# EAGLE schematic analog_homoThermistor_3xChannel_R1 (EAGLE 7.6.0)
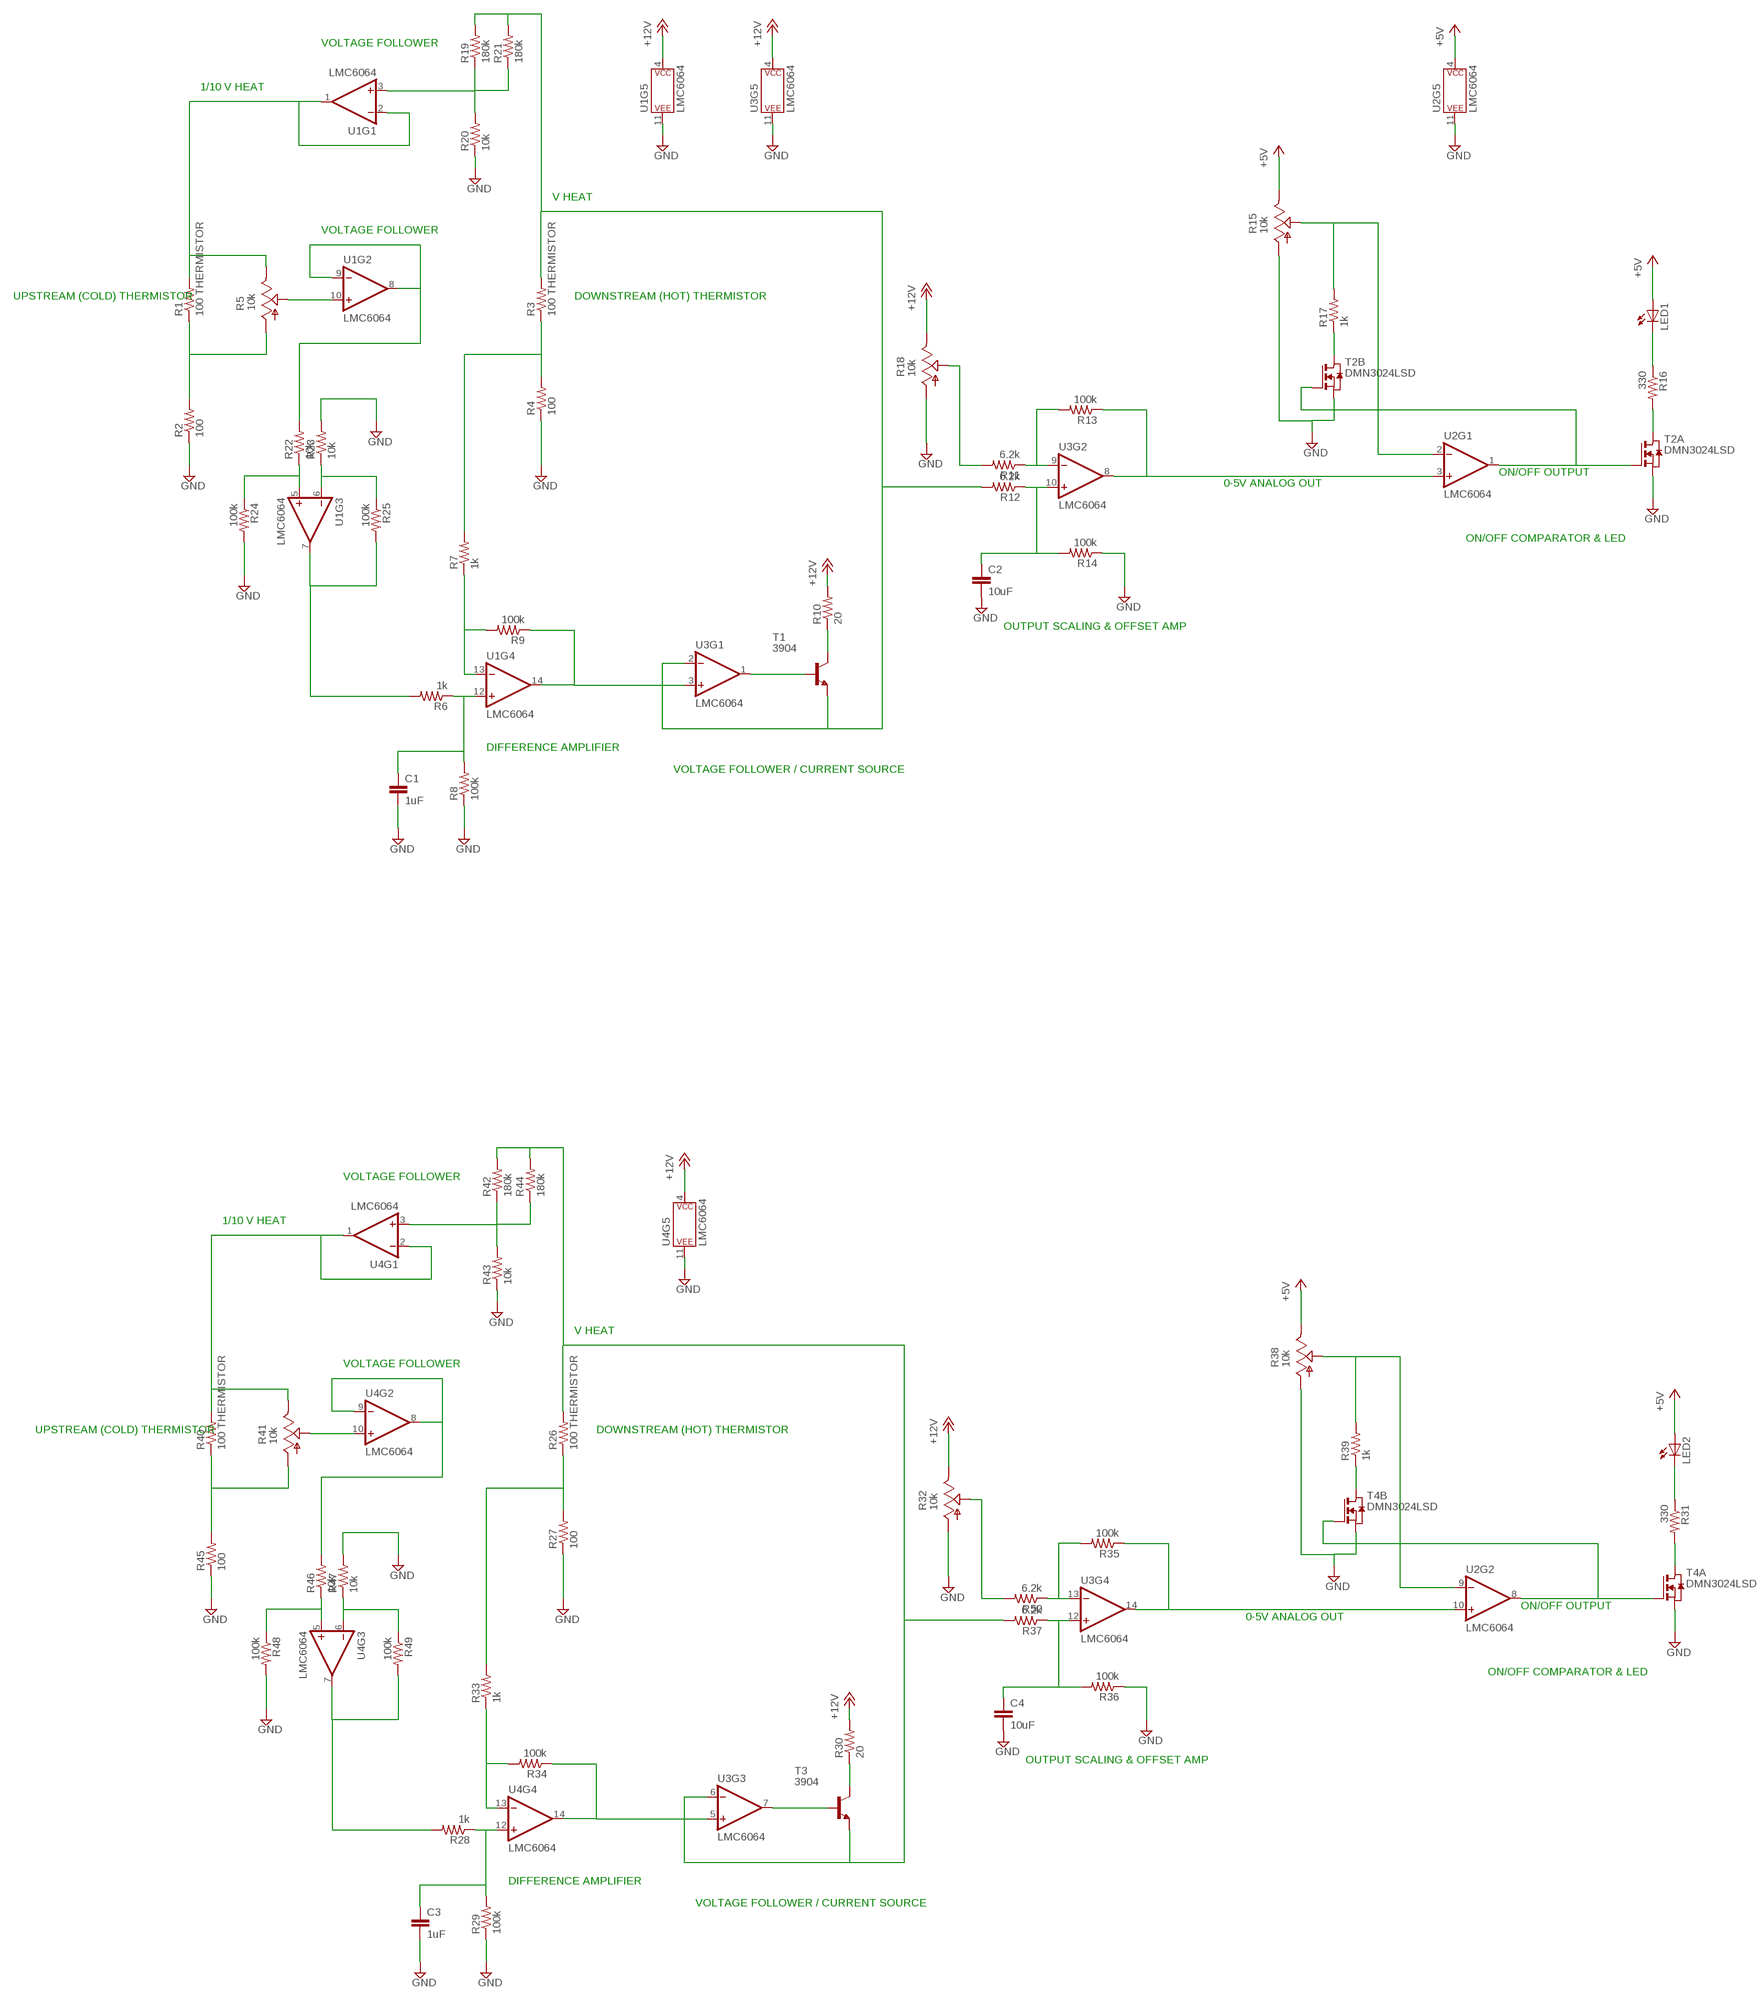
[diagram p0: schematic, sheet 1, part 1 of 2]
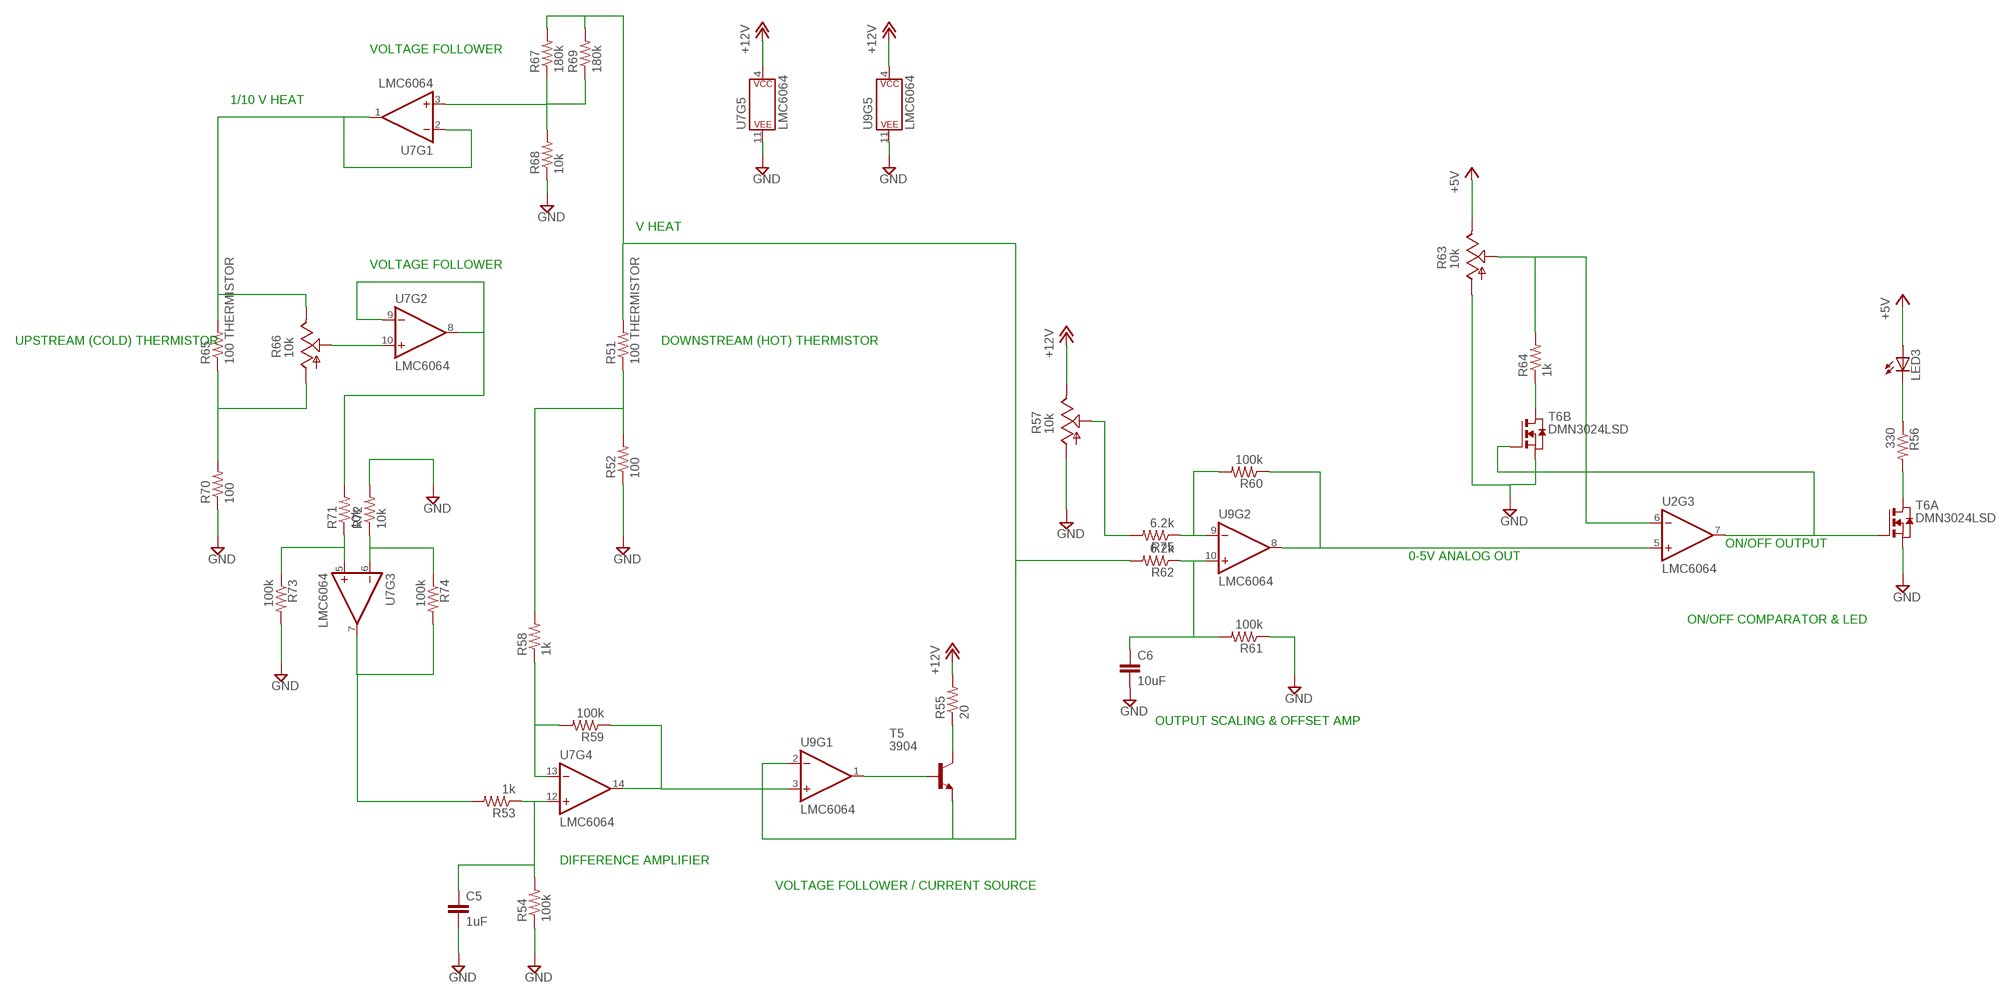
[diagram p1: schematic, sheet 1, part 2 of 2]

## Parts
C1  1uF  C-EUC0603  [C0603]
C2  10uF  C-EUC0603  [C0603]
C3  1uF  C-EUC0603  [C0603]
C4  10uF  C-EUC0603  [C0603]
C5  1uF  C-EUC0603  [C0603]
C6  10uF  C-EUC0603  [C0603]
LED1  LEDCHIPLED_1206  [CHIPLED_1206]
LED2  LEDCHIPLED_1206  [CHIPLED_1206]
LED3  LEDCHIPLED_1206  [CHIPLED_1206]
R1  100 THERMISTOR  R-US_R0603  [R0603]
R2  100  R-US_R0603  [R0603]
R3  100 THERMISTOR  R-US_R0603  [R0603]
R4  100  R-US_R0603  [R0603]
R5  10k  TRIM_US-SM-42/43W  [SM-42/43W]
R6  1k  R-US_R0603  [R0603]
R7  1k  R-US_R0603  [R0603]
R8  100k  R-US_R0603  [R0603]
R9  100k  R-US_R0603  [R0603]
R10  20  R-US_R0603  [R0603]
R11  6.2k  R-US_R0603  [R0603]
R12  6.2k  R-US_R0603  [R0603]
R13  100k  R-US_R0603  [R0603]
R14  100k  R-US_R0603  [R0603]
R15  10k  TRIM_US-SM-42/43W  [SM-42/43W]
R16  330  R-US_R0603  [R0603]
R17  1k  R-US_R0603  [R0603]
R18  10k  TRIM_US-SM-42/43W  [SM-42/43W]
R19  180k  R-US_R0603  [R0603]
R20  10k  R-US_R0603  [R0603]
R21  180k  R-US_R0603  [R0603]
R22  10k  R-US_R0603  [R0603]
R23  10k  R-US_R0603  [R0603]
R24  100k  R-US_R0603  [R0603]
R25  100k  R-US_R0603  [R0603]
R26  100 THERMISTOR  R-US_R0603  [R0603]
R27  100  R-US_R0603  [R0603]
R28  1k  R-US_R0603  [R0603]
R29  100k  R-US_R0603  [R0603]
R30  20  R-US_R0603  [R0603]
R31  330  R-US_R0603  [R0603]
R32  10k  TRIM_US-SM-42/43W  [SM-42/43W]
R33  1k  R-US_R0603  [R0603]
R34  100k  R-US_R0603  [R0603]
R35  100k  R-US_R0603  [R0603]
R36  100k  R-US_R0603  [R0603]
R37  6.2k  R-US_R0603  [R0603]
R38  10k  TRIM_US-SM-42/43W  [SM-42/43W]
R39  1k  R-US_R0603  [R0603]
R40  100 THERMISTOR  R-US_R0603  [R0603]
R41  10k  TRIM_US-SM-42/43W  [SM-42/43W]
R42  180k  R-US_R0603  [R0603]
R43  10k  R-US_R0603  [R0603]
R44  180k  R-US_R0603  [R0603]
R45  100  R-US_R0603  [R0603]
R46  10k  R-US_R0603  [R0603]
R47  10k  R-US_R0603  [R0603]
R48  100k  R-US_R0603  [R0603]
R49  100k  R-US_R0603  [R0603]
R50  6.2k  R-US_R0603  [R0603]
R51  100 THERMISTOR  R-US_R0603  [R0603]
R52  100  R-US_R0603  [R0603]
R53  1k  R-US_R0603  [R0603]
R54  100k  R-US_R0603  [R0603]
R55  20  R-US_R0603  [R0603]
R56  330  R-US_R0603  [R0603]
R57  10k  TRIM_US-SM-42/43W  [SM-42/43W]
R58  1k  R-US_R0603  [R0603]
R59  100k  R-US_R0603  [R0603]
R60  100k  R-US_R0603  [R0603]
R61  100k  R-US_R0603  [R0603]
R62  6.2k  R-US_R0603  [R0603]
R63  10k  TRIM_US-SM-42/43W  [SM-42/43W]
R64  1k  R-US_R0603  [R0603]
R65  100 THERMISTOR  R-US_R0603  [R0603]
R66  10k  TRIM_US-SM-42/43W  [SM-42/43W]
R67  180k  R-US_R0603  [R0603]
R68  10k  R-US_R0603  [R0603]
R69  180k  R-US_R0603  [R0603]
R70  100  R-US_R0603  [R0603]
R71  10k  R-US_R0603  [R0603]
R72  10k  R-US_R0603  [R0603]
R73  100k  R-US_R0603  [R0603]
R74  100k  R-US_R0603  [R0603]
R75  6.2k  R-US_R0603  [R0603]
T1  3904  MMBT3904LT1-NPN-SOT23-BEC  [SOT23-BEC]
T2  DMN3024LSD  [SO8]
T3  3904  MMBT3904LT1-NPN-SOT23-BEC  [SOT23-BEC]
T4  DMN3024LSD  [SO8]
T5  3904  MMBT3904LT1-NPN-SOT23-BEC  [SOT23-BEC]
T6  DMN3024LSD  [SO8]
U1  LMC6064  [SO14]
U2  LMC6064  [SO14]
U3  LMC6064  [SO14]
U4  LMC6064  [SO14]
U7  LMC6064  [SO14]
U9  LMC6064  [SO14]

## Nets
+5V: LED1.A LED2.A LED3.A R15.3(E) R38.3(E) R63.3(E) U2.4(P$V+)
+12V: R10.2 R18.3(E) R30.2 R32.3(E) R55.2 R57.3(E) U1.4(P$V+) U3.4(P$V+) U4.4(P$V+) U7.4(P$V+) U9.4(P$V+)
GND: C1.2 C2.2 C3.2 C4.2 C5.2 C6.2 R2.1 R4.1 R8.1 R14.1 R15.1(A) R18.1(A) R20.1 R23.2 R24.2 R27.1 R29.1 R32.1(A) R36.1 R38.1(A) R43.1 R45.1 R47.2 R48.2 R52.1 R54.1 R57.1(A) R61.1 R63.1(A) R68.1 R70.1 R72.2 R73.2 T2.1(A:S) T2.3(B:S) T4.1(A:S) T4.3(B:S) T6.1(A:S) T6.3(B:S) U1.11(P$V-) U2.11(P$V-) U3.11(P$V-) U4.11(P$V-) U7.11(P$V-) U9.11(P$V-)
N$1: R5.2(S) U1.10(+IN)
N$2: T2.2(A:G) T2.4(B:G) U2.1(OUT)
N$3: R1.1 R2.2 R5.1(A)
N$4: T1.B U3.1(OUT)
N$5: R22.2 U1.8(OUT) U1.9(-IN)
N$6: R7.1 R9.2 U1.13(-IN)
N$7: R9.1 U1.14(OUT) U3.3(+IN)
N$8: C1.1 R6.1 R8.2 U1.12(+IN)
N$9: R3.1 R4.2 R7.2
N$10: R3.2 R12.2 R19.2 R21.2 T1.E U3.2(-IN)
N$11: R10.1 T1.C
N$12: C2.1 R12.1 R14.2 U3.10(+IN)
N$13: R11.1 R13.2 U3.9(-IN)
N$14: R15.2(S) R17.2 U2.2(-IN)
N$15: R13.1 U2.3(+IN) U3.8(OUT)
N$16: R16.2 T2.7(A:D) T2.8(A:D)
N$17: LED1.C R16.1
N$18: R1.2 R5.3(E) U1.1(OUT) U1.2(-IN)
N$19: R19.1 R20.2 R21.1 U1.3(+IN)
N$20: R17.1 T2.5(B:D) T2.6(B:D)
N$21: R22.1 R24.1 U1.5(+IN)
N$22: R11.2 R18.2(S)
N$23: R41.2(S) U4.10(+IN)
N$24: R23.1 R25.1 U1.6(-IN)
N$25: R6.2 R25.2 U1.7(OUT)
N$26: R40.1 R41.1(A) R45.2
N$27: R46.2 U4.8(OUT) U4.9(-IN)
N$28: R26.1 R27.2 R33.2
N$29: R26.2 R37.2 R42.2 R44.2 T3.E U3.6(-IN)
N$30: C4.1 R36.2 R37.1 U3.12(+IN)
N$31: R35.2 R50.1 U3.13(-IN)
N$32: R38.2(S) R39.2 U2.9(-IN)
N$33: R35.1 U2.10(+IN) U3.14(OUT)
N$34: T4.2(A:G) T4.4(B:G) U2.8(OUT)
N$35: LED2.C R31.1
N$36: T3.B U3.7(OUT)
N$37: R30.1 T3.C
N$38: R31.2 T4.7(A:D) T4.8(A:D)
N$39: R39.1 T4.5(B:D) T4.6(B:D)
N$40: R32.2(S) R50.2
N$41: R40.2 R41.3(E) U4.1(OUT) U4.2(-IN)
N$42: R42.1 R43.2 R44.1 U4.3(+IN)
N$43: R33.1 R34.2 U4.13(-IN)
N$44: R34.1 U3.5(+IN) U4.14(OUT)
N$45: C3.1 R28.1 R29.2 U4.12(+IN)
N$46: R46.1 R48.1 U4.5(+IN)
N$47: R47.1 R49.1 U4.6(-IN)
N$48: R28.2 R49.2 U4.7(OUT)
N$49: R66.2(S) U7.10(+IN)
N$50: R65.1 R66.1(A) R70.2
N$51: R71.2 U7.8(OUT) U7.9(-IN)
N$52: R51.1 R52.2 R58.2
N$53: R51.2 R62.2 R67.2 R69.2 T5.E U9.2(-IN)
N$54: C6.1 R61.2 R62.1 U9.10(+IN)
N$55: R60.2 R75.1 U9.9(-IN)
N$56: R63.2(S) R64.2 U2.6(-IN)
N$57: R60.1 U2.5(+IN) U9.8(OUT)
N$58: T6.2(A:G) T6.4(B:G) U2.7(OUT)
N$59: LED3.C R56.1
N$60: T5.B U9.1(OUT)
N$61: R55.1 T5.C
N$62: R56.2 T6.7(A:D) T6.8(A:D)
N$63: R64.1 T6.5(B:D) T6.6(B:D)
N$64: R57.2(S) R75.2
N$65: R65.2 R66.3(E) U7.1(OUT) U7.2(-IN)
N$66: R67.1 R68.2 R69.1 U7.3(+IN)
N$67: R58.1 R59.2 U7.13(-IN)
N$68: R59.1 U7.14(OUT) U9.3(+IN)
N$69: C5.1 R53.1 R54.2 U7.12(+IN)
N$70: R71.1 R73.1 U7.5(+IN)
N$71: R72.1 R74.1 U7.6(-IN)
N$72: R53.2 R74.2 U7.7(OUT)
Unconnected: U2.12(+IN) U2.13(-IN) U2.14(OUT) U9.5(+IN) U9.6(-IN) U9.7(OUT) U9.12(+IN) U9.13(-IN) U9.14(OUT)

## Notes on the sheet
- VOLTAGE FOLLOWER
- 1/10 V HEAT
- V HEAT
- VOLTAGE FOLLOWER
- UPSTREAM (COLD) THERMISTOR | DOWNSTREAM (HOT) THERMISTOR
- ON/OFF OUTPUT
- 0-5V ANALOG OUT
- ON/OFF COMPARATOR & LED
- OUTPUT SCALING & OFFSET AMP
- DIFFERENCE AMPLIFIER
- VOLTAGE FOLLOWER / CURRENT SOURCE
- VOLTAGE FOLLOWER
- 1/10 V HEAT
- V HEAT
- VOLTAGE FOLLOWER
- UPSTREAM (COLD) THERMISTOR | DOWNSTREAM (HOT) THERMISTOR
- ON/OFF OUTPUT
- 0-5V ANALOG OUT
- ON/OFF COMPARATOR & LED
- OUTPUT SCALING & OFFSET AMP
- DIFFERENCE AMPLIFIER
- VOLTAGE FOLLOWER / CURRENT SOURCE
- VOLTAGE FOLLOWER
- 1/10 V HEAT
- V HEAT
- VOLTAGE FOLLOWER
- UPSTREAM (COLD) THERMISTOR | DOWNSTREAM (HOT) THERMISTOR
- ON/OFF OUTPUT
- 0-5V ANALOG OUT
- ON/OFF COMPARATOR & LED
- OUTPUT SCALING & OFFSET AMP
- DIFFERENCE AMPLIFIER
- VOLTAGE FOLLOWER / CURRENT SOURCE

## Library data of the parts
C1 C3 C5 = resistor:C-EU: CAPACITOR, European symbol; DISTR: Digikey; DISTRPN: 490-1536-1-ND; MF: Murata Electronics North America; MPN: GRM188R61C105KA93D
C2 C4 C6 = resistor:C-EU: CAPACITOR, European symbol; DISTR: Digikey; DISTRPN: 490-7198-1-ND; MF: Murata Electronics North America; MPN: GRM188C81C106MA73D
LED1-LED3 = led:LED: LED OSRAM: - CHIPLED LG R971, LG N971, LY N971, LG Q971, LY Q971, LO R971, LY R971 LH N974, LH R974 LS Q976, LO Q976, LY Q976 LO Q996 - Hyper CHIPLED LW Q18S LB Q993, LB Q99A, LB R99A - SideLED LS A670, LO A670, LY A670, LG A670, LP A670 LB A673, LV A673, LT A673, LW A673 LH A674 LY A675 LS A676, LA A676, LO A676, LY A676, LW A676 LS A679, LY A679, LG A679 - Hyper Micro SIDELED® LS Y876, LA Y876, LO Y876, LY Y876 LT Y87S - SmartLED LW L88C, LW L88S LB L89C, LB L89S, LG L890 LS L89K, LO L89K, LY L89K LS L896, LA L896, LO L896, LY L896 - TOPLED LS T670, LO T670, LY T670, LG T670, LP T670 LSG T670, LSP T670, LSY T670, LOP T670, LYG T670 LG T671, LOG T671, LSG T671 LB T673, LV T673, LT T673, LW T673 LH T674 LS T676, LA T676, LO T676, LY T676, LB T676, LH T676, LSB T676, LW T676 LB T67C, LV T67C, LT T67C, LS T67K, LO T67K, LY T67K, LW E67C LS E67B, LA E67B, LO E67B, LY E67B, LB E67C, LV E67C, LT E67C LW T67C LS T679, LY T679, LG T679 LS T770, LO T770, LY T770, LG T770, LP T770 LB T773, LV T773, LT T773, LW T773 LH T774 LS E675, LA E675, LY E675, LS T675 LS T776, LA T776, LO T776, LY T776, LB T776 LHGB T686 LT T68C, LB T68C - Hyper Mini TOPLED® LB M676 - Mini TOPLED Santana® LG M470 LS M47K, LO M47K, LY M47K Source: http://www.osram.convergy.de LUXEON: - LUMILED® LXK2-PW12-R00, LXK2-PW12-S00, LXK2-PW14-U00, LXK2-PW14-V00 LXK2-PM12-R00, LXK2-PM12-S00, LXK2-PM14-U00 LXK2-PE12-Q00, LXK2-PE12-R00, LXK2-PE12-S00, LXK2-PE14-T00, LXK2-PE14-U00 LXK2-PB12-K00, LXK2-PB12-L00, LXK2-PB12-M00, LXK2-PB14-N00, LXK2-PB14-P00, LXK2-PB14-Q00 LXK2-PR12-L00, LXK2-PR12-M00, LXK2-PR14-Q00, LXK2-PR14-R00 LXK2-PD12-Q00, LXK2-PD12-R00, LXK2-PD12-S00 LXK2-PH12-R00, LXK2-PH12-S00 LXK2-PL12-P00, LXK2-PL12-Q00, LXK2-PL12-R00 Source: www.luxeon.com KINGBRIGHT: KA-3528ASYC Source: www.kingbright.com; DISTR: Digikey; DISTRPN: 160-1169-1-ND; MF: Lite-On Inc.; MPN: LTST-C150GKT
R1 R3 R26 R40 R51 R65 = resistor:R-US_: RESISTOR, American symbol; DISTR: Digikey; DISTRPN: 490-2434-1-ND; MF: Murata Electronics North America; MPN: NCP18XF101J03RB
R2 R4 R27 R45 R52 R70 = resistor:R-US_: RESISTOR, American symbol; DISTR: Digikey; DISTRPN: P100BYCT-ND; MF: Panasonic Electronic Components; MPN: ERJ-PA3F1000V
R5 R15 R18 R32 R38 R41 R57 R63 R66 = pot:TRIM_US-: POTENTIOMETER; DISTR: Digikey; DISTRPN: SM-42TW103CT-ND; MF: Copal Electronics Inc.; MPN: SM-42TW103
R6 R7 R17 R28 R33 R39 R53 R58 R64 = resistor:R-US_: RESISTOR, American symbol; DISTR: Digikey; DISTRPN: P1.0KBYCT-ND; MF: Panasonic Electronic Components; MPN: ERJ-PA3F1001V
R8 R9 R13 R14 R24 R25 R29 R34-R36 R48 R49 R54 R59-R61 R73 R74 = resistor:R-US_: RESISTOR, American symbol; DISTR: Digikey; DISTRPN: P100KBYCT-ND; MF: Panasonic Electronic Components; MPN: ERJ-PA3F1003V
R10 R30 R55 = resistor:R-US_: RESISTOR, American symbol; DISTR: Digikey; DISTRPN: P20.00BYCT-ND; MF: Panasonic Electronic Components; MPN: ERJ-PA3F20R0V
R11 R12 R37 R50 R62 R75 = resistor:R-US_: RESISTOR, American symbol; DISTR: Digikey; DISTRPN: P6.2KBYCT-ND; MF: Panasonic Electronic Components; MPN: ERJ-PA3F6201V
R16 R31 R56 = resistor:R-US_: RESISTOR, American symbol; DISTR: Digikey; DISTRPN: P330BYCT-ND; MF: Panasonic Electronic Components; MPN: ERJ-PA3F3300V
R19 R21 R42 R44 R67 R69 = resistor:R-US_: RESISTOR, American symbol; DISTR: Digikey; DISTRPN: P180KBYCT-ND; MF: Panasonic Electronic Components; MPN: ERJ-PA3F1803V
R20 R22 R23 R43 R46 R47 R68 R71 R72 = resistor:R-US_: RESISTOR, American symbol; DISTR: Digikey; DISTRPN: P10KBYCT-ND; MF: Panasonic Electronic Components; MPN: ERJ-PA3F1002V
T1 T3 T5 = transistor-neu-to92:*-NPN-: NPN Transistror; DISTR: Digikey; DISTRPN: MMBT3904FSCT-ND; MF: Fairchild/ON Semiconductor; MPN: MMBT3904
T2 T4 T6 = zetex:DMN3024LSD: 30V DUAL N-CHANNEL ENHANCEMENT MODE MOSFET Source: Data sheet <http://www.diodes.com/datasheets/DMN3024LSD.pdf>; DISTR: Digikey; DISTRPN: DMN3024LSD-13DICT-ND; MF: Diodes Incorporated; MPN: DMN3024LSD-13; OC_FARNELL: unknown; OC_NEWARK: unknown
U1-U4 U7 U9 = SparkFun-IC-Amplifiers:LMC6064: IC LMV324 Quad Op Amp Jellybean quad op-amp Datasheet <http://cdn.sparkfun.com/datasheets/Sensors/Sound/LMV324.pdf> SparkFun Products SparkFun Sensor Kit <https://www.sparkfun.com/products/13754> (DEV-13754) SparkFun Inventor's Kit for Arduino 101 <https://www.sparkfun.com/products/13844> (KIT-13844) SparkFun Sound Detector <https://www.sparkfun.com/products/12642> (SEN-12642); DISTR: Digikey; DISTRPN: 296-35438-1-ND; MF: Texas Instruments; MPN: LMC6064AIMX/NOPB; PROD_ID: LMC6064